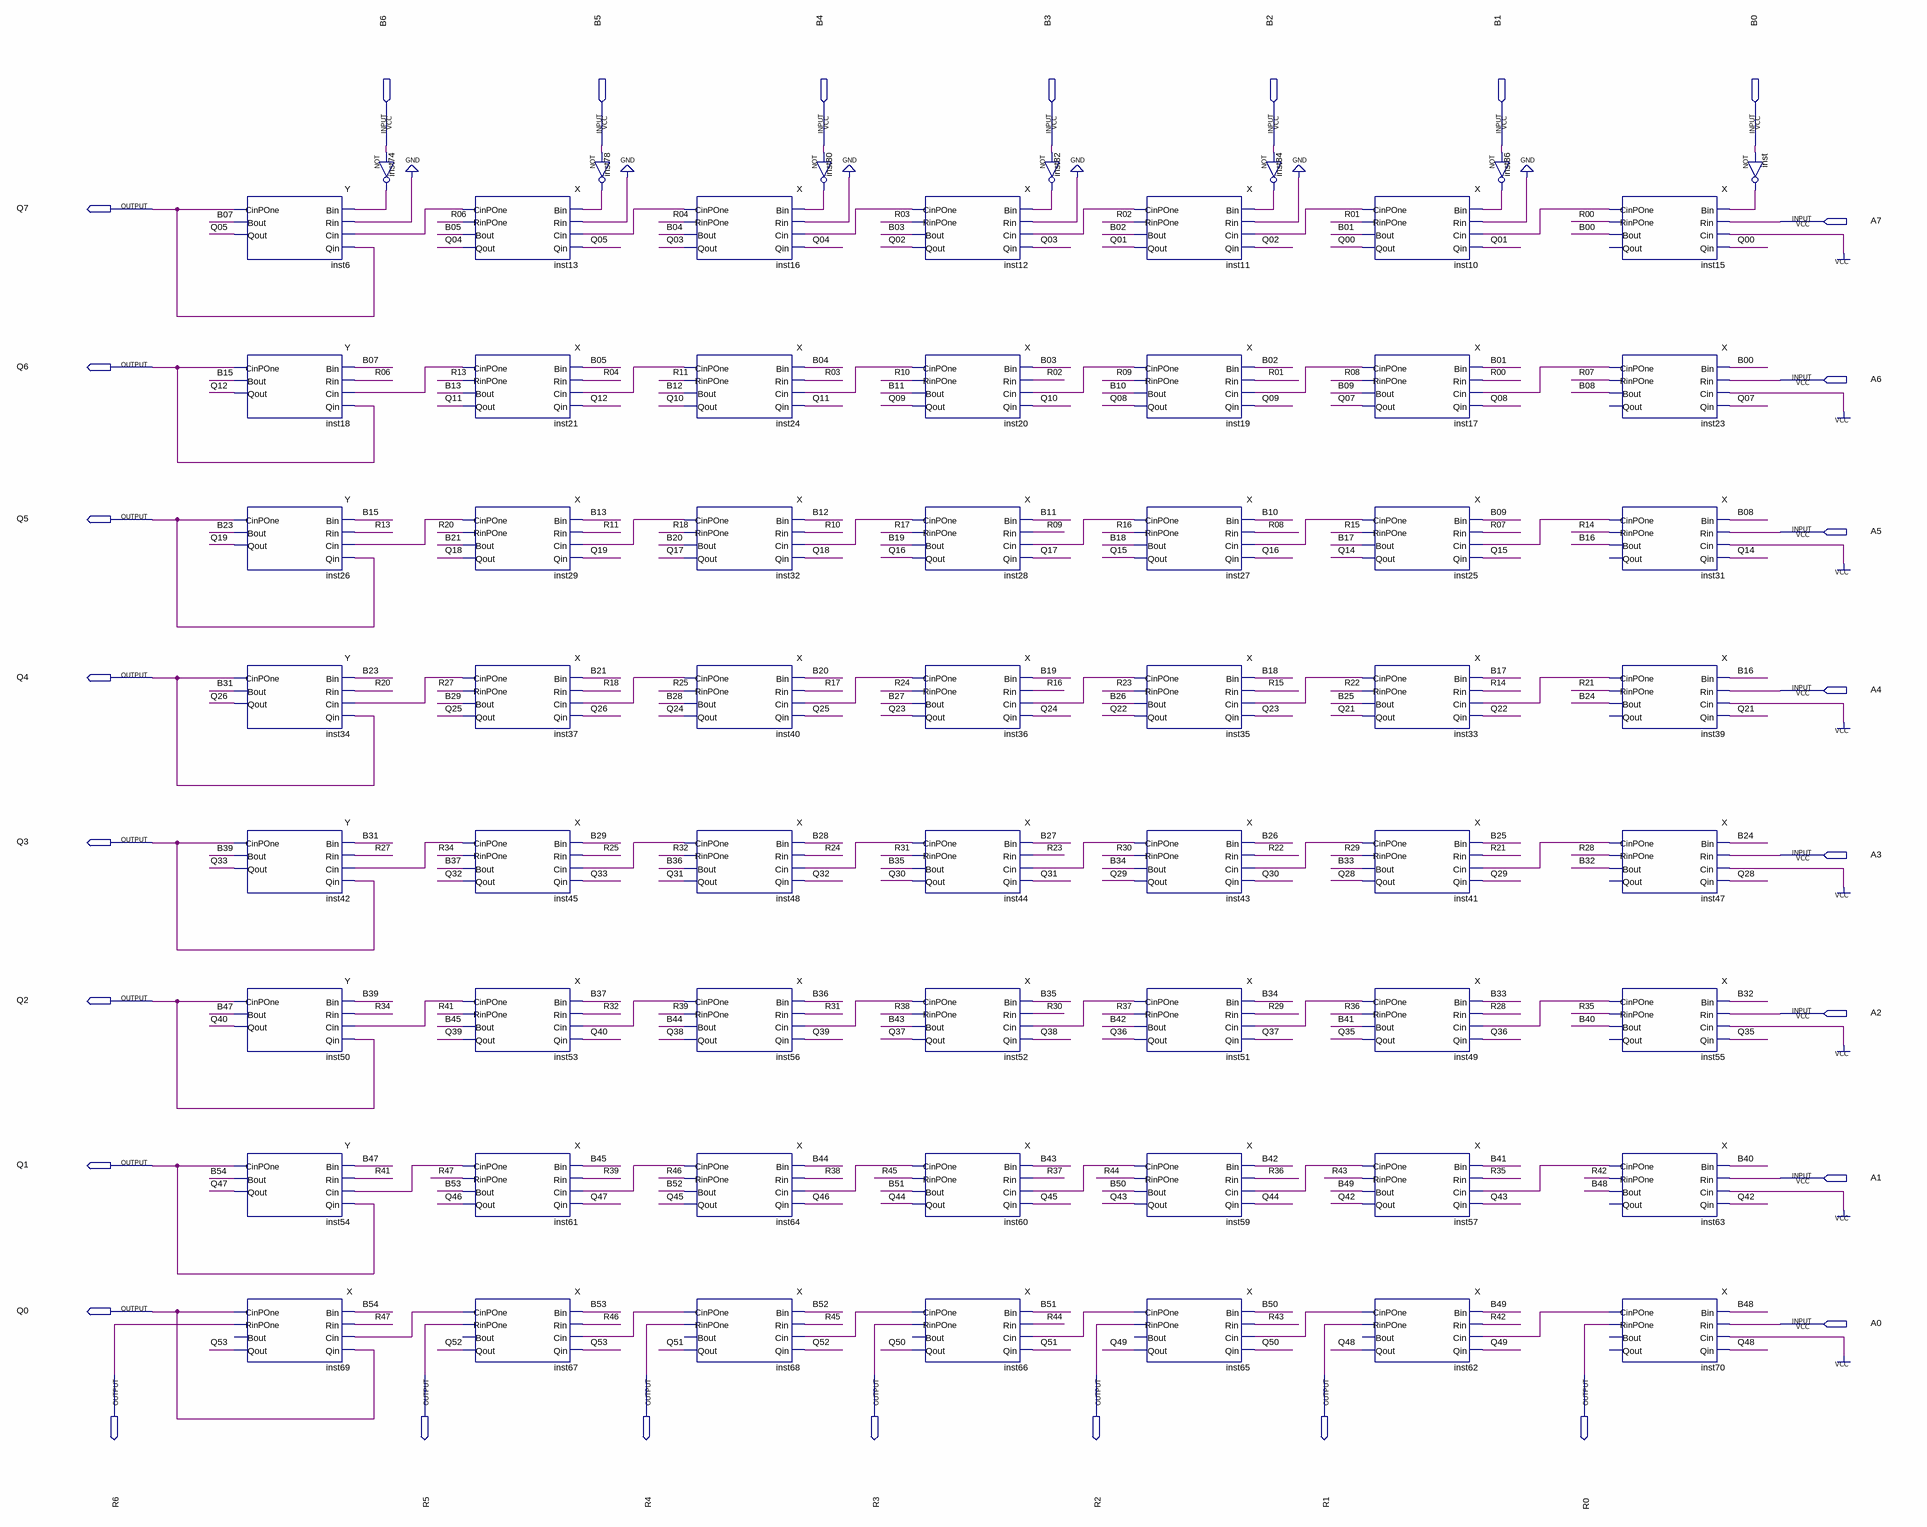
[diagram p0: schematic sheet]
// Quartus schematic DividerSystem.bdf as structural Verilog: 63 symbols, 30 pins
module DividerSystem (
  input  B6,
  input  B5,
  input  B4,
  input  B3,
  input  B2,
  input  B1,
  input  B0,
  input  A7,
  input  A6,
  input  A5,
  input  A4,
  input  A3,
  input  A2,
  input  A1,
  input  A0,
  output Q7,
  output Q6,
  output Q5,
  output Q4,
  output Q3,
  output Q2,
  output Q1,
  output Q0,
  output R6,
  output R5,
  output R4,
  output R3,
  output R2,
  output R1,
  output R0
);

  wire B00, B01, B02, B03, B04, B05, B07, B08, B09, B10, B11, B12, B13, B15, B16, B17, B18, B19, B20, B21,
       B23, B24, B25, B26, B27, B28, B29, B31, B32, B33, B34, B35, B36, B37, B39, B40, B41, B42, B43, B44,
       B45, B47, B48, B49, B50, B51, B52, B53, B54, inst10_cinpone, inst11_cinpone, inst12_cinpone,
       inst13_cinpone, inst15_cinpone, inst16_cinpone, inst17_cinpone, inst19_cinpone, inst20_cinpone,
       inst21_cinpone, inst23_cinpone, inst24_cinpone, inst25_cinpone, inst27_cinpone, inst28_cinpone,
       inst29_cinpone, inst31_cinpone, inst32_cinpone, inst33_cinpone, inst35_cinpone, inst36_cinpone,
       inst37_cinpone, inst39_cinpone, inst40_cinpone, inst41_cinpone, inst43_cinpone, inst44_cinpone,
       inst45_cinpone, inst47_cinpone, inst48_cinpone, inst49_cinpone, inst51_cinpone, inst52_cinpone,
       inst53_cinpone, inst55_cinpone, inst56_cinpone, inst57_cinpone, inst59_cinpone, inst60_cinpone,
       inst61_cinpone, inst62_cinpone, inst63_cinpone, inst64_cinpone, inst65_cinpone, inst66_cinpone,
       inst67_cinpone, inst68_cinpone, inst70_cinpone, inst74_out, inst78_out, inst80_out, inst82_out,
       inst84_out, inst86_out, inst_out, Q00, Q01, Q02, Q03, Q04, Q05, Q07, Q08, Q09, Q10, Q11, Q12, Q14,
       Q15, Q16, Q17, Q18, Q19, Q21, Q22, Q23, Q24, Q25, Q26, Q28, Q29, Q30, Q31, Q32, Q33, Q35, Q36, Q37,
       Q38, Q39, Q40, Q42, Q43, Q44, Q45, Q46, Q47, Q48, Q49, Q50, Q51, Q52, Q53, R00, R01, R02, R03, R04,
       R06, R07, R08, R09, R10, R11, R13, R14, R15, R16, R17, R18, R20, R21, R22, R23, R24, R25, R27, R28,
       R29, R30, R31, R32, R34, R35, R36, R37, R38, R39, R41, R42, R43, R44, R45, R46, R47;

  Y inst6 (.Bin(inst74_out), .Rin(1'b0), .Cin(inst13_cinpone), .Qin(Q7), .CinPOne(Q7), .Bout(B07), .Qout(Q05));
  Y inst18 (.Bin(B07), .Rin(R06), .Cin(inst21_cinpone), .Qin(Q6), .CinPOne(Q6), .Bout(B15), .Qout(Q12));
  Y inst26 (.Bin(B15), .Rin(R13), .Cin(inst29_cinpone), .Qin(Q5), .CinPOne(Q5), .Bout(B23), .Qout(Q19));
  Y inst34 (.Bin(B23), .Rin(R20), .Cin(inst37_cinpone), .Qin(Q4), .CinPOne(Q4), .Bout(B31), .Qout(Q26));
  Y inst42 (.Bin(B31), .Rin(R27), .Cin(inst45_cinpone), .Qin(Q3), .CinPOne(Q3), .Bout(B39), .Qout(Q33));
  Y inst50 (.Bin(B39), .Rin(R34), .Cin(inst53_cinpone), .Qin(Q2), .CinPOne(Q2), .Bout(B47), .Qout(Q40));
  Y inst54 (.Bin(B47), .Rin(R41), .Cin(inst61_cinpone), .Qin(Q1), .CinPOne(Q1), .Bout(B54), .Qout(Q47));
  X inst69 (
    .Bin(B54), .Rin(R47), .Cin(inst67_cinpone), .Qin(Q0), .CinPOne(Q0), .RinPOne(R6), .Qout(Q53));  // open: Bout
  not inst74 (inst74_out, B6);
  X inst13 (
    .Bin(inst78_out), .Rin(1'b0), .Cin(inst16_cinpone), .Qin(Q05), .CinPOne(inst13_cinpone), .RinPOne(R06),
    .Bout(B05), .Qout(Q04));
  X inst21 (
    .Bin(B05), .Rin(R04), .Cin(inst24_cinpone), .Qin(Q12), .CinPOne(inst21_cinpone), .RinPOne(R13),
    .Bout(B13), .Qout(Q11));
  X inst29 (
    .Bin(B13), .Rin(R11), .Cin(inst32_cinpone), .Qin(Q19), .CinPOne(inst29_cinpone), .RinPOne(R20),
    .Bout(B21), .Qout(Q18));
  X inst37 (
    .Bin(B21), .Rin(R18), .Cin(inst40_cinpone), .Qin(Q26), .CinPOne(inst37_cinpone), .RinPOne(R27),
    .Bout(B29), .Qout(Q25));
  X inst45 (
    .Bin(B29), .Rin(R25), .Cin(inst48_cinpone), .Qin(Q33), .CinPOne(inst45_cinpone), .RinPOne(R34),
    .Bout(B37), .Qout(Q32));
  X inst53 (
    .Bin(B37), .Rin(R32), .Cin(inst56_cinpone), .Qin(Q40), .CinPOne(inst53_cinpone), .RinPOne(R41),
    .Bout(B45), .Qout(Q39));
  X inst61 (
    .Bin(B45), .Rin(R39), .Cin(inst64_cinpone), .Qin(Q47), .CinPOne(inst61_cinpone), .RinPOne(R47),
    .Bout(B53), .Qout(Q46));
  X inst67 (
    .Bin(B53), .Rin(R46), .Cin(inst68_cinpone), .Qin(Q53), .CinPOne(inst67_cinpone), .RinPOne(R5), .Qout(Q52));  // open: Bout
  not inst78 (inst78_out, B5);
  X inst16 (
    .Bin(inst80_out), .Rin(1'b0), .Cin(inst12_cinpone), .Qin(Q04), .CinPOne(inst16_cinpone), .RinPOne(R04),
    .Bout(B04), .Qout(Q03));
  X inst24 (
    .Bin(B04), .Rin(R03), .Cin(inst20_cinpone), .Qin(Q11), .CinPOne(inst24_cinpone), .RinPOne(R11),
    .Bout(B12), .Qout(Q10));
  X inst32 (
    .Bin(B12), .Rin(R10), .Cin(inst28_cinpone), .Qin(Q18), .CinPOne(inst32_cinpone), .RinPOne(R18),
    .Bout(B20), .Qout(Q17));
  X inst40 (
    .Bin(B20), .Rin(R17), .Cin(inst36_cinpone), .Qin(Q25), .CinPOne(inst40_cinpone), .RinPOne(R25),
    .Bout(B28), .Qout(Q24));
  X inst48 (
    .Bin(B28), .Rin(R24), .Cin(inst44_cinpone), .Qin(Q32), .CinPOne(inst48_cinpone), .RinPOne(R32),
    .Bout(B36), .Qout(Q31));
  X inst56 (
    .Bin(B36), .Rin(R31), .Cin(inst52_cinpone), .Qin(Q39), .CinPOne(inst56_cinpone), .RinPOne(R39),
    .Bout(B44), .Qout(Q38));
  X inst64 (
    .Bin(B44), .Rin(R38), .Cin(inst60_cinpone), .Qin(Q46), .CinPOne(inst64_cinpone), .RinPOne(R46),
    .Bout(B52), .Qout(Q45));
  X inst68 (
    .Bin(B52), .Rin(R45), .Cin(inst66_cinpone), .Qin(Q52), .CinPOne(inst68_cinpone), .RinPOne(R4), .Qout(Q51));  // open: Bout
  not inst80 (inst80_out, B4);
  X inst12 (
    .Bin(inst82_out), .Rin(1'b0), .Cin(inst11_cinpone), .Qin(Q03), .CinPOne(inst12_cinpone), .RinPOne(R03),
    .Bout(B03), .Qout(Q02));
  X inst20 (
    .Bin(B03), .Rin(R02), .Cin(inst19_cinpone), .Qin(Q10), .CinPOne(inst20_cinpone), .RinPOne(R10),
    .Bout(B11), .Qout(Q09));
  X inst28 (
    .Bin(B11), .Rin(R09), .Cin(inst27_cinpone), .Qin(Q17), .CinPOne(inst28_cinpone), .RinPOne(R17),
    .Bout(B19), .Qout(Q16));
  X inst36 (
    .Bin(B19), .Rin(R16), .Cin(inst35_cinpone), .Qin(Q24), .CinPOne(inst36_cinpone), .RinPOne(R24),
    .Bout(B27), .Qout(Q23));
  X inst44 (
    .Bin(B27), .Rin(R23), .Cin(inst43_cinpone), .Qin(Q31), .CinPOne(inst44_cinpone), .RinPOne(R31),
    .Bout(B35), .Qout(Q30));
  X inst52 (
    .Bin(B35), .Rin(R30), .Cin(inst51_cinpone), .Qin(Q38), .CinPOne(inst52_cinpone), .RinPOne(R38),
    .Bout(B43), .Qout(Q37));
  X inst60 (
    .Bin(B43), .Rin(R37), .Cin(inst59_cinpone), .Qin(Q45), .CinPOne(inst60_cinpone), .RinPOne(R45),
    .Bout(B51), .Qout(Q44));
  X inst66 (
    .Bin(B51), .Rin(R44), .Cin(inst65_cinpone), .Qin(Q51), .CinPOne(inst66_cinpone), .RinPOne(R3), .Qout(Q50));  // open: Bout
  not inst82 (inst82_out, B3);
  X inst11 (
    .Bin(inst84_out), .Rin(1'b0), .Cin(inst10_cinpone), .Qin(Q02), .CinPOne(inst11_cinpone), .RinPOne(R02),
    .Bout(B02), .Qout(Q01));
  X inst19 (
    .Bin(B02), .Rin(R01), .Cin(inst17_cinpone), .Qin(Q09), .CinPOne(inst19_cinpone), .RinPOne(R09),
    .Bout(B10), .Qout(Q08));
  X inst27 (
    .Bin(B10), .Rin(R08), .Cin(inst25_cinpone), .Qin(Q16), .CinPOne(inst27_cinpone), .RinPOne(R16),
    .Bout(B18), .Qout(Q15));
  X inst35 (
    .Bin(B18), .Rin(R15), .Cin(inst33_cinpone), .Qin(Q23), .CinPOne(inst35_cinpone), .RinPOne(R23),
    .Bout(B26), .Qout(Q22));
  X inst43 (
    .Bin(B26), .Rin(R22), .Cin(inst41_cinpone), .Qin(Q30), .CinPOne(inst43_cinpone), .RinPOne(R30),
    .Bout(B34), .Qout(Q29));
  X inst51 (
    .Bin(B34), .Rin(R29), .Cin(inst49_cinpone), .Qin(Q37), .CinPOne(inst51_cinpone), .RinPOne(R37),
    .Bout(B42), .Qout(Q36));
  X inst59 (
    .Bin(B42), .Rin(R36), .Cin(inst57_cinpone), .Qin(Q44), .CinPOne(inst59_cinpone), .RinPOne(R44),
    .Bout(B50), .Qout(Q43));
  X inst65 (
    .Bin(B50), .Rin(R43), .Cin(inst62_cinpone), .Qin(Q50), .CinPOne(inst65_cinpone), .RinPOne(R2), .Qout(Q49));  // open: Bout
  not inst84 (inst84_out, B2);
  X inst10 (
    .Bin(inst86_out), .Rin(1'b0), .Cin(inst15_cinpone), .Qin(Q01), .CinPOne(inst10_cinpone), .RinPOne(R01),
    .Bout(B01), .Qout(Q00));
  X inst17 (
    .Bin(B01), .Rin(R00), .Cin(inst23_cinpone), .Qin(Q08), .CinPOne(inst17_cinpone), .RinPOne(R08),
    .Bout(B09), .Qout(Q07));
  X inst25 (
    .Bin(B09), .Rin(R07), .Cin(inst31_cinpone), .Qin(Q15), .CinPOne(inst25_cinpone), .RinPOne(R15),
    .Bout(B17), .Qout(Q14));
  X inst33 (
    .Bin(B17), .Rin(R14), .Cin(inst39_cinpone), .Qin(Q22), .CinPOne(inst33_cinpone), .RinPOne(R22),
    .Bout(B25), .Qout(Q21));
  X inst41 (
    .Bin(B25), .Rin(R21), .Cin(inst47_cinpone), .Qin(Q29), .CinPOne(inst41_cinpone), .RinPOne(R29),
    .Bout(B33), .Qout(Q28));
  X inst49 (
    .Bin(B33), .Rin(R28), .Cin(inst55_cinpone), .Qin(Q36), .CinPOne(inst49_cinpone), .RinPOne(R36),
    .Bout(B41), .Qout(Q35));
  X inst57 (
    .Bin(B41), .Rin(R35), .Cin(inst63_cinpone), .Qin(Q43), .CinPOne(inst57_cinpone), .RinPOne(R43),
    .Bout(B49), .Qout(Q42));
  X inst62 (
    .Bin(B49), .Rin(R42), .Cin(inst70_cinpone), .Qin(Q49), .CinPOne(inst62_cinpone), .RinPOne(R1), .Qout(Q48));  // open: Bout
  not inst86 (inst86_out, B1);
  X inst15 (
    .Bin(inst_out), .Rin(A7), .Cin(1'b1), .Qin(Q00), .CinPOne(inst15_cinpone), .RinPOne(R00), .Bout(B00));  // open: Qout
  X inst23 (
    .Bin(B00), .Rin(A6), .Cin(1'b1), .Qin(Q07), .CinPOne(inst23_cinpone), .RinPOne(R07), .Bout(B08));  // open: Qout
  X inst31 (
    .Bin(B08), .Rin(A5), .Cin(1'b1), .Qin(Q14), .CinPOne(inst31_cinpone), .RinPOne(R14), .Bout(B16));  // open: Qout
  X inst39 (
    .Bin(B16), .Rin(A4), .Cin(1'b1), .Qin(Q21), .CinPOne(inst39_cinpone), .RinPOne(R21), .Bout(B24));  // open: Qout
  X inst47 (
    .Bin(B24), .Rin(A3), .Cin(1'b1), .Qin(Q28), .CinPOne(inst47_cinpone), .RinPOne(R28), .Bout(B32));  // open: Qout
  X inst55 (
    .Bin(B32), .Rin(A2), .Cin(1'b1), .Qin(Q35), .CinPOne(inst55_cinpone), .RinPOne(R35), .Bout(B40));  // open: Qout
  X inst63 (
    .Bin(B40), .Rin(A1), .Cin(1'b1), .Qin(Q42), .CinPOne(inst63_cinpone), .RinPOne(R42), .Bout(B48));  // open: Qout
  X inst70 (.Bin(B48), .Rin(A0), .Cin(1'b1), .Qin(Q48), .CinPOne(inst70_cinpone), .RinPOne(R0));  // open: Bout, Qout
  not inst (inst_out, B0);
endmodule
